# Altium schematic sheet polosyzeros.SchDoc
size A4; SheetNumber: 12; SheetTotal: 12
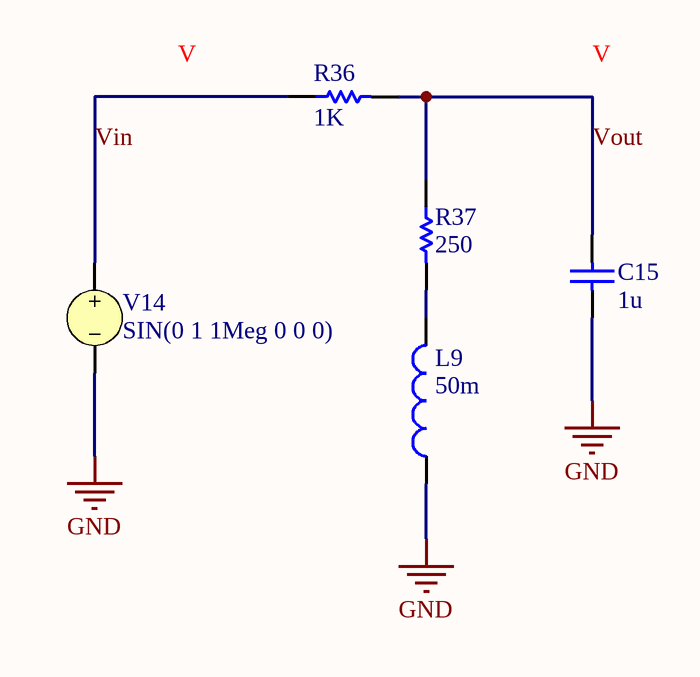
[diagram p0: polosyzeros.SchDoc]

## Parts
C15  value 1u  (hidden comment: Capacitor)
L9  value 50m  (hidden comment: Inductor)
R36  value 1K  (hidden comment: Resistor)
R37  value 250  (hidden comment: Resistor)
V14  SIN(0 1 1Meg 0 0 0)

## Nets
GND: C15.1 L9.1 V14.2
Vin: R36.1 V14.1
Vout: C15.2 R36.2 R37.1
NetL9_2: L9.2 R37.2

## Library data of the parts
C15 = Capacitor: SimulationGenericComponent: True
L9 = Inductor: SimulationGenericComponent: True
R36 R37 = Resistor: TC1: 0; SimulationGenericComponent: True; TC2: 0
V14 = VSRC: Voltage Source; Note: PCB Footprint - Not required; AC Magnitude: 1; AC Phase: 0; DC Magnitude: 5; Published: 8-Jun-2000; LatestRevisionDate: 17-Jul-2002; LatestRevisionNote: Re-released for DXP Platform.; PackageReference: Not Applicable; Publisher: Altium Limited; Offset: 0; Amplitude: 1; Frequency: 1Meg; Delay: 0; Damping Factor: 0; Phase: 0